# Altium schematic sheet Module.SchDoc: Module
size A; DocumentNumber: 14; SheetNumber: 14; SheetTotal: 22
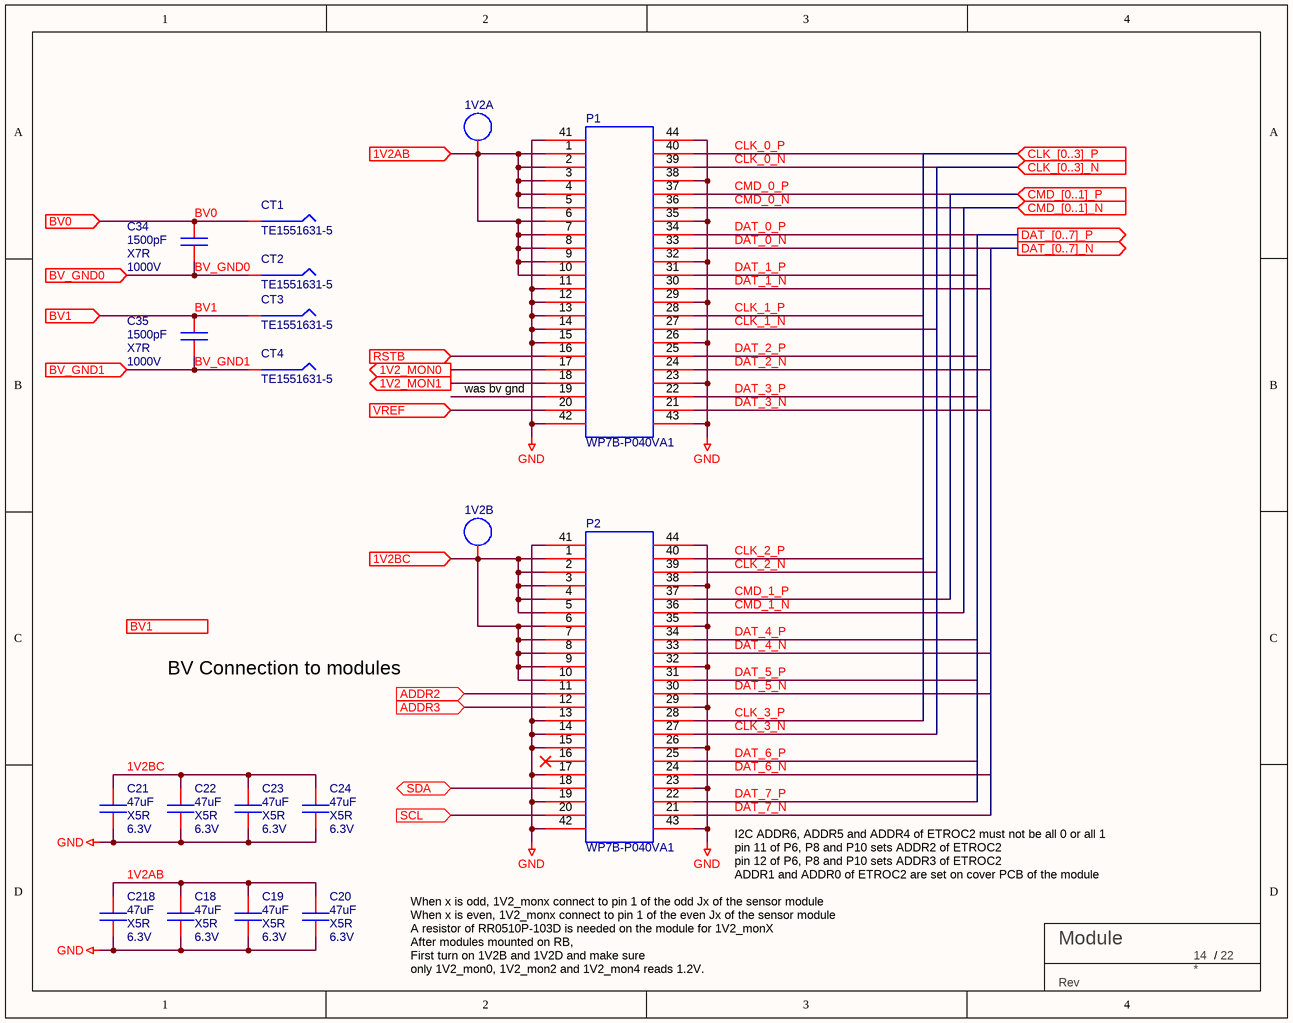
[diagram p0: Module.SchDoc]

## Parts
C18  47uF  Voltage: 6.3V  TempCo: X5R  [C_0603_IPC]
C19  47uF  Voltage: 6.3V  TempCo: X5R  [C_0603_IPC]
C20  47uF  Voltage: 6.3V  TempCo: X5R  [C_0603_IPC]
C21  47uF  Voltage: 6.3V  TempCo: X5R  [C_0603_IPC]
C22  47uF  Voltage: 6.3V  TempCo: X5R  [C_0603_IPC]
C23  47uF  Voltage: 6.3V  TempCo: X5R  [C_0603_IPC]
C24  47uF  Voltage: 6.3V  TempCo: X5R  [C_0603_IPC]
C34  value 1500pF  TempCo: X7R  Voltage: 1000V  [C_0805_IPC]  (hidden comment: C0805X7R102-152MNE)
C35  value 1500pF  TempCo: X7R  Voltage: 1000V  [C_0805_IPC]  (hidden comment: C0805X7R102-152MNE)
C218  47uF  Voltage: 6.3V  TempCo: X5R  [C_0603_IPC]
CT1  TE1551631-5  [contact]
CT2  TE1551631-5  [contact]
CT3  TE1551631-5  [contact]
CT4  TE1551631-5  [contact]
P1  WP7B-P040VA1  [wp7b-40p]
P2  WP7B-P040VA1  [wp7b-40p]
TBLOCK?  BU Title block  (value not drawn)  (graphical)
TP1  1V2A  [testpoint]  (no BOM)
TP2  1V2B  [testpoint]  (no BOM)

## Ports
1V2_MON0 (out), 1V2_MON1 (out), 1V2AB (in), 1V2BC (in), ADDR2 (in), ADDR3 (in), BV0 (in), BV1 (in), BV_GND0 (in), BV_GND1 (in), CLK_[0..3]_N (in), CLK_[0..3]_P (in), CMD_[0..1]_N (in), CMD_[0..1]_P (in), DAT_[0..7]_N (out), DAT_[0..7]_P (out), RSTB (in), SCL (in), SDA (bidir), VREF (in)

## Nets
GND: C18.2 C19.2 C20.2 C21.2 C22.2 C23.2 C24.2 C218.2 P1.11 P1.12 P1.13 P1.14 P1.15 P1.23 P1.26 P1.29 P1.32 P1.35 P1.38 P1.41 P1.42 P1.43 P1.44 P2.13 P2.14 P2.15 P2.17 P2.19 P2.23 P2.26 P2.29 P2.32 P2.35 P2.38 P2.41 P2.42 P2.43 P2.44
1V2_MON0: P1.17 ; port 1V2_MON0
1V2_MON1: P1.18 ; port 1V2_MON1
1V2AB: P1.1 P1.2 P1.3 P1.4 P1.5 P1.6 P1.7 P1.8 P1.9 P1.10 TP1.1(TP) ; port 1V2AB
1V2AB: C18.1 C19.1 C20.1 C218.1  [a separate net that carries the same name]
1V2BC: P2.1 P2.2 P2.3 P2.4 P2.5 P2.6 P2.7 P2.8 P2.9 P2.10 TP2.1(TP) ; port 1V2BC
1V2BC: C21.1 C22.1 C23.1 C24.1  [a separate net that carries the same name]
ADDR2: P2.11 ; port ADDR2
ADDR3: P2.12 ; port ADDR3
BV0: C34.2 CT1.1 ; port BV0
BV1: C35.2 CT3.1 ; port BV1
BV_GND0: C34.1 CT2.1 ; port BV_GND0
BV_GND1: C35.1 CT4.1 ; port BV_GND1
CLK_0_N: P1.39
CLK_0_P: P1.40
CLK_1_N: P1.27
CLK_1_P: P1.28
CLK_2_N: P2.39
CLK_2_P: P2.40
CLK_3_N: P2.27
CLK_3_P: P2.28
CMD_0_N: P1.36
CMD_0_P: P1.37
CMD_1_N: P2.36
CMD_1_P: P2.37
DAT_0_N: P1.33
DAT_0_P: P1.34
DAT_1_N: P1.30
DAT_1_P: P1.31
DAT_2_N: P1.24
DAT_2_P: P1.25
DAT_3_N: P1.21
DAT_3_P: P1.22
DAT_4_N: P2.33
DAT_4_P: P2.34
DAT_5_N: P2.30
DAT_5_P: P2.31
DAT_6_N: P2.24
DAT_6_P: P2.25
DAT_7_N: P2.21
DAT_7_P: P2.22
RSTB: P1.16 ; port RSTB
SCL: P2.20 ; port SCL
SDA: P2.18 ; port SDA
VREF: P1.20 ; port VREF

Not connected (* = marked no-connect by the designer): P1 19; P2 16*

## Notes on the sheet
- was bv gnd
- BV Connection to modules
- I2C ADDR6, ADDR5 and ADDR4 of ETROC2 must not be all 0 or all 1
- When x is odd, 1V2_monx connect to pin 1 of the odd Jx of the sensor module
- pin 11 of P6, P8 and P10 sets ADDR2 of ETROC2
- pin 12 of P6, P8 and P10 sets ADDR3 of ETROC2
- (near TBLOCK?) ADDR1 and ADDR0 of ETROC2 are set on cover PCB of the module
- A resistor of RR0510P-103D is needed on the module for 1V2_monX
- After modules mounted on RB,
- First turn on 1V2B and 1V2D and make sure
- only 1V2_mon0, 1V2_mon2 and 1V2_mon4 reads 1.2V.
- When x is even, 1V2_monx connect to pin 1 of the even Jx of the sensor module
- (in symbol TITLE_BLOCK_BU) /; Rev

## Library data of the parts
C18-C24 C218 = C-CER-E6-47uF-0603-6.3V-X5R: CAP CER 47UF 6.3V X5R 0603; Supplier 1: Arrow Electronics; Supplier Part Number 1: GRM188R60J476ME15D
C34 C35 = C-CER-E12-1500pF-0805-1000V-X7R: 1500 pF ±20% 1000V (1kV) Ceramic Capacitor X7R 0805 (2012 Metric); Tolerance: 20%
CT1-CT4 = CONTACT
P1 P2 = WP7B-40P: plug
TBLOCK? = TITLE_BLOCK_BU
TP1 TP2 = TP: TEST POINT 40MIL DIA.